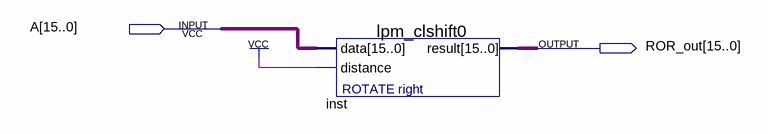
[diagram p0: schematic sheet]
// Quartus schematic ROR.bdf as structural Verilog: 1 symbols, 2 pins
module ROR (
  input  [15:0] A,
  output [15:0] ROR_out
);

  lpm_clshift0 inst (.data(A), .distance(1'b1), .result(ROR_out));
endmodule
